# Altium schematic sheet main.SchDoc
size A4; PageSetup: Record=PageOptions|CenterHorizontal=True|CenterVertical=True|PrintScale=1.00|XCorrection=1.00|YCorrection=1.00|PrintKind=0|BorderSize=5000000|LeftOffset=0|BottomOffset=0|Orientation=2|PaperLength=1000|PaperWidth=1000|Scale=100|PaperSource=7|PrintQuality=2400|MediaType=1|DitherType=10|PaperKind=A4|PrintScaleMode=1
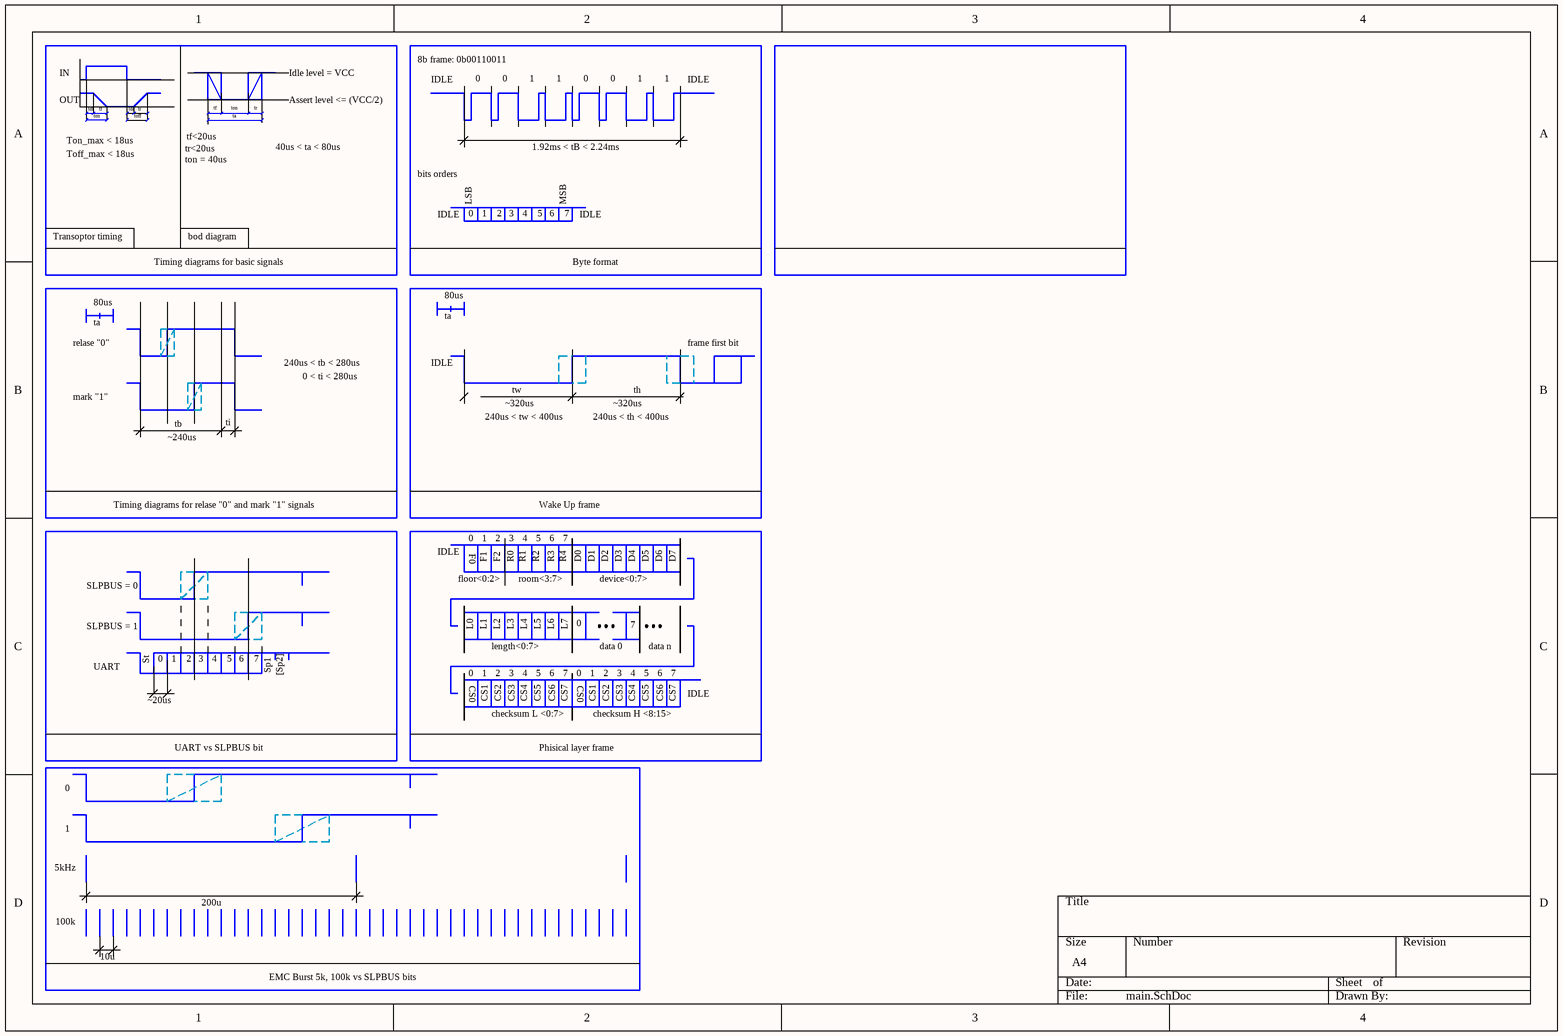
[diagram p0: main.SchDoc]

## Notes on the sheet
- IN
- OUT
- tdf
- ton
- tf
- tdr
- toff
- tr
- ta
- Idle level = VCC
- Assert level <= (VCC/2)
- 8b frame: 0b00110011
- IDLE
- 0
- 1
- Ton_max < 18us
- Toff_max < 18us
- tr<20us
- ton = 40us
- tf<20us
- 40us < ta < 80us
- bits orders
- 1.92ms < tB < 2.24ms
- Transoptor timing
- bod diagram
- LSB
- 2
- 3
- 4
- 5
- 6
- 7
- MSB
- 80us
- Timing diagrams for basic signals
- Byte format
- relase "0"
- 240us < tb < 280us
- 0 < ti < 280us
- frame first bit
- mark "1"
- ~240us
- tb
- ti
- 240us < tw < 400us
- ~320us
- tw
- 240us < th < 400us
- th
- Timing diagrams for relase "0" and mark "1" signals
- Wake Up frame
- floor<0:2>
- F0
- F1
- F2
- R0
- room<3:7>
- R1
- R2
- R3
- R4
- D0
- D1
- device<0:7>
- D2
- D3
- D4
- D5
- D6
- D7
- SLPBUS = 0
- SLPBUS = 1
- L0
- L1
- length<0:7>
- L2
- L3
- L4
- L5
- L6
- L7
- data 0
- data n
- UART
- ~20us
- St
- Sp1
- [Sp2]
- CS0
- CS1
- checksum L <0:7>
- CS2
- CS3
- CS4
- CS5
- CS6
- CS7
- checksum H <8:15>
- UART vs SLPBUS bit
- Phisical layer frame
- 5kHz
- 100k
- 200u
- 10u
- EMC Burst 5k, 100k vs SLPBUS bits